# Altium project Project-C_VOLTAGE.PrjPCB (part 6 of 6)
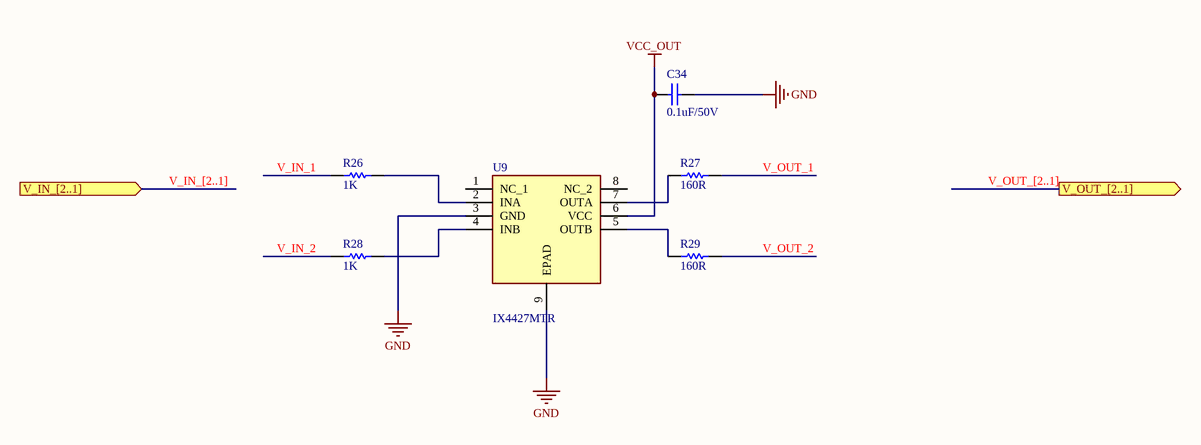
[diagram p13: VoltageAmplifier.SchDoc]

## Nets that join several sheets (continued)
V_OUT230: VoltageHeaders (P_E_4.6), U_VoltageAmplifier_1xFPGA4/U_VoltageAmplifier3 (R27_U_VoltageAmplifier_1xFPGA4_U_VoltageAmplifier3.2)
V_OUT231: VoltageHeaders (P_E_4.8), U_VoltageAmplifier_1xFPGA4/U_VoltageAmplifier3 (R29_U_VoltageAmplifier_1xFPGA4_U_VoltageAmplifier3.2)
V_OUT232: VoltageHeaders (P_E_4.7), U_VoltageAmplifier_1xFPGA4/U_VoltageAmplifier4 (R27_U_VoltageAmplifier_1xFPGA4_U_VoltageAmplifier4.2)
V_OUT233: VoltageHeaders (P_E_4.5), U_VoltageAmplifier_1xFPGA4/U_VoltageAmplifier4 (R29_U_VoltageAmplifier_1xFPGA4_U_VoltageAmplifier4.2)
V_OUT234: VoltageHeaders (P_E_4.10), U_VoltageAmplifier_1xFPGA4/U_VoltageAmplifier5 (R27_U_VoltageAmplifier_1xFPGA4_U_VoltageAmplifier5.2)
V_OUT251: VoltageHeaders (P_E_4.28), U_VoltageAmplifier_1xFPGA4/U_VoltageAmplifier13 (R29_U_VoltageAmplifier_1xFPGA4_U_VoltageAmplifier13.2)
V_OUT252: VoltageHeaders (P_E_4.27), U_VoltageAmplifier_1xFPGA4/U_VoltageAmplifier14 (R27_U_VoltageAmplifier_1xFPGA4_U_VoltageAmplifier14.2)
V_OUT253: VoltageHeaders (P_E_4.25), U_VoltageAmplifier_1xFPGA4/U_VoltageAmplifier14 (R29_U_VoltageAmplifier_1xFPGA4_U_VoltageAmplifier14.2)
V_OUT254: VoltageHeaders (P_E_4.30), U_VoltageAmplifier_1xFPGA4/U_VoltageAmplifier15 (R27_U_VoltageAmplifier_1xFPGA4_U_VoltageAmplifier15.2)
V_OUT255: VoltageHeaders (P_E_4.32), U_VoltageAmplifier_1xFPGA4/U_VoltageAmplifier15 (R29_U_VoltageAmplifier_1xFPGA4_U_VoltageAmplifier15.2)
V_OUT256: VoltageHeaders (P_E_4.31), U_VoltageAmplifier_1xFPGA4/U_VoltageAmplifier16 (R27_U_VoltageAmplifier_1xFPGA4_U_VoltageAmplifier16.2)
V_OUT257: VoltageHeaders (P_E_4.29), U_VoltageAmplifier_1xFPGA4/U_VoltageAmplifier16 (R29_U_VoltageAmplifier_1xFPGA4_U_VoltageAmplifier16.2)
V_OUT258: VoltageHeaders (P_E_4.34), U_VoltageAmplifier_1xFPGA4/U_VoltageAmplifier17 (R27_U_VoltageAmplifier_1xFPGA4_U_VoltageAmplifier17.2)
V_OUT259: VoltageHeaders (P_E_4.36), U_VoltageAmplifier_1xFPGA4/U_VoltageAmplifier17 (R29_U_VoltageAmplifier_1xFPGA4_U_VoltageAmplifier17.2)
V_OUT260: VoltageHeaders (P_E_4.35), U_VoltageAmplifier_1xFPGA4/U_VoltageAmplifier18 (R27_U_VoltageAmplifier_1xFPGA4_U_VoltageAmplifier18.2)
V_OUT261: VoltageHeaders (P_E_4.33), U_VoltageAmplifier_1xFPGA4/U_VoltageAmplifier18 (R29_U_VoltageAmplifier_1xFPGA4_U_VoltageAmplifier18.2)
V_OUT262: VoltageHeaders (P_E_4.38), U_VoltageAmplifier_1xFPGA4/U_VoltageAmplifier19 (R27_U_VoltageAmplifier_1xFPGA4_U_VoltageAmplifier19.2)
V_OUT263: VoltageHeaders (P_E_4.37), U_VoltageAmplifier_1xFPGA4/U_VoltageAmplifier19 (R29_U_VoltageAmplifier_1xFPGA4_U_VoltageAmplifier19.2)
V_OUT264: VoltageHeaders (P_O_4.3), U_VoltageAmplifier_1xFPGA4/U_VoltageAmplifier20 (R27_U_VoltageAmplifier_1xFPGA4_U_VoltageAmplifier20.2)
V_OUT265: VoltageHeaders (P_O_4.1), U_VoltageAmplifier_1xFPGA4/U_VoltageAmplifier20 (R29_U_VoltageAmplifier_1xFPGA4_U_VoltageAmplifier20.2)
V_OUT266: VoltageHeaders (P_O_4.2), U_VoltageAmplifier_1xFPGA4/U_VoltageAmplifier21 (R27_U_VoltageAmplifier_1xFPGA4_U_VoltageAmplifier21.2)
V_OUT267: VoltageHeaders (P_O_4.4), U_VoltageAmplifier_1xFPGA4/U_VoltageAmplifier21 (R29_U_VoltageAmplifier_1xFPGA4_U_VoltageAmplifier21.2)
V_OUT268: VoltageHeaders (P_O_4.7), U_VoltageAmplifier_1xFPGA4/U_VoltageAmplifier22 (R27_U_VoltageAmplifier_1xFPGA4_U_VoltageAmplifier22.2)
V_OUT269: VoltageHeaders (P_O_4.5), U_VoltageAmplifier_1xFPGA4/U_VoltageAmplifier22 (R29_U_VoltageAmplifier_1xFPGA4_U_VoltageAmplifier22.2)
V_OUT270: VoltageHeaders (P_O_4.6), U_VoltageAmplifier_1xFPGA4/U_VoltageAmplifier23 (R27_U_VoltageAmplifier_1xFPGA4_U_VoltageAmplifier23.2)
V_OUT271: VoltageHeaders (P_O_4.8), U_VoltageAmplifier_1xFPGA4/U_VoltageAmplifier23 (R29_U_VoltageAmplifier_1xFPGA4_U_VoltageAmplifier23.2)
V_OUT272: VoltageHeaders (P_O_4.11), U_VoltageAmplifier_1xFPGA4/U_VoltageAmplifier24 (R27_U_VoltageAmplifier_1xFPGA4_U_VoltageAmplifier24.2)
V_OUT273: VoltageHeaders (P_O_4.9), U_VoltageAmplifier_1xFPGA4/U_VoltageAmplifier24 (R29_U_VoltageAmplifier_1xFPGA4_U_VoltageAmplifier24.2)
V_OUT274: VoltageHeaders (P_O_4.10), U_VoltageAmplifier_1xFPGA4/U_VoltageAmplifier25 (R27_U_VoltageAmplifier_1xFPGA4_U_VoltageAmplifier25.2)
V_OUT275: VoltageHeaders (P_O_4.12), U_VoltageAmplifier_1xFPGA4/U_VoltageAmplifier25 (R29_U_VoltageAmplifier_1xFPGA4_U_VoltageAmplifier25.2)
V_OUT276: VoltageHeaders (P_O_4.15), U_VoltageAmplifier_1xFPGA4/U_VoltageAmplifier26 (R27_U_VoltageAmplifier_1xFPGA4_U_VoltageAmplifier26.2)
V_OUT277: VoltageHeaders (P_O_4.13), U_VoltageAmplifier_1xFPGA4/U_VoltageAmplifier26 (R29_U_VoltageAmplifier_1xFPGA4_U_VoltageAmplifier26.2)
V_OUT278: VoltageHeaders (P_O_4.14), U_VoltageAmplifier_1xFPGA4/U_VoltageAmplifier27 (R27_U_VoltageAmplifier_1xFPGA4_U_VoltageAmplifier27.2)
V_OUT279: VoltageHeaders (P_O_4.16), U_VoltageAmplifier_1xFPGA4/U_VoltageAmplifier27 (R29_U_VoltageAmplifier_1xFPGA4_U_VoltageAmplifier27.2)
V_OUT280: VoltageHeaders (P_O_4.19), U_VoltageAmplifier_1xFPGA4/U_VoltageAmplifier28 (R27_U_VoltageAmplifier_1xFPGA4_U_VoltageAmplifier28.2)
V_OUT281: VoltageHeaders (P_O_4.17), U_VoltageAmplifier_1xFPGA4/U_VoltageAmplifier28 (R29_U_VoltageAmplifier_1xFPGA4_U_VoltageAmplifier28.2)
V_OUT282: VoltageHeaders (P_O_4.18), U_VoltageAmplifier_1xFPGA4/U_VoltageAmplifier29 (R27_U_VoltageAmplifier_1xFPGA4_U_VoltageAmplifier29.2)
V_OUT283: VoltageHeaders (P_O_4.20), U_VoltageAmplifier_1xFPGA4/U_VoltageAmplifier29 (R29_U_VoltageAmplifier_1xFPGA4_U_VoltageAmplifier29.2)
V_OUT284: VoltageHeaders (P_O_4.23), U_VoltageAmplifier_1xFPGA4/U_VoltageAmplifier30 (R27_U_VoltageAmplifier_1xFPGA4_U_VoltageAmplifier30.2)
V_OUT285: VoltageHeaders (P_O_4.21), U_VoltageAmplifier_1xFPGA4/U_VoltageAmplifier30 (R29_U_VoltageAmplifier_1xFPGA4_U_VoltageAmplifier30.2)
V_OUT286: VoltageHeaders (P_O_4.22), U_VoltageAmplifier_1xFPGA4/U_VoltageAmplifier31 (R27_U_VoltageAmplifier_1xFPGA4_U_VoltageAmplifier31.2)
V_OUT287: VoltageHeaders (P_O_4.24), U_VoltageAmplifier_1xFPGA4/U_VoltageAmplifier31 (R29_U_VoltageAmplifier_1xFPGA4_U_VoltageAmplifier31.2)
V_OUT288: VoltageHeaders (P_O_4.27), U_VoltageAmplifier_1xFPGA4/U_VoltageAmplifier32 (R27_U_VoltageAmplifier_1xFPGA4_U_VoltageAmplifier32.2)
V_OUT289: VoltageHeaders (P_O_4.25), U_VoltageAmplifier_1xFPGA4/U_VoltageAmplifier32 (R29_U_VoltageAmplifier_1xFPGA4_U_VoltageAmplifier32.2)
V_OUT290: VoltageHeaders (P_O_4.26), U_VoltageAmplifier_1xFPGA4/U_VoltageAmplifier33 (R27_U_VoltageAmplifier_1xFPGA4_U_VoltageAmplifier33.2)
V_OUT291: VoltageHeaders (P_O_4.28), U_VoltageAmplifier_1xFPGA4/U_VoltageAmplifier33 (R29_U_VoltageAmplifier_1xFPGA4_U_VoltageAmplifier33.2)
V_OUT292: VoltageHeaders (P_O_4.31), U_VoltageAmplifier_1xFPGA4/U_VoltageAmplifier34 (R27_U_VoltageAmplifier_1xFPGA4_U_VoltageAmplifier34.2)
V_OUT293: VoltageHeaders (P_O_4.29), U_VoltageAmplifier_1xFPGA4/U_VoltageAmplifier34 (R29_U_VoltageAmplifier_1xFPGA4_U_VoltageAmplifier34.2)
V_OUT294: VoltageHeaders (P_O_4.30), U_VoltageAmplifier_1xFPGA4/U_VoltageAmplifier35 (R27_U_VoltageAmplifier_1xFPGA4_U_VoltageAmplifier35.2)
V_OUT295: VoltageHeaders (P_O_4.32), U_VoltageAmplifier_1xFPGA4/U_VoltageAmplifier35 (R29_U_VoltageAmplifier_1xFPGA4_U_VoltageAmplifier35.2)
V_OUT296: VoltageHeaders (P_O_4.35), U_VoltageAmplifier_1xFPGA4/U_VoltageAmplifier36 (R27_U_VoltageAmplifier_1xFPGA4_U_VoltageAmplifier36.2)
V_OUT297: VoltageHeaders (P_O_4.33), U_VoltageAmplifier_1xFPGA4/U_VoltageAmplifier36 (R29_U_VoltageAmplifier_1xFPGA4_U_VoltageAmplifier36.2)
V_OUT298: VoltageHeaders (P_O_4.34), U_VoltageAmplifier_1xFPGA4/U_VoltageAmplifier37 (R27_U_VoltageAmplifier_1xFPGA4_U_VoltageAmplifier37.2)
V_OUT299: VoltageHeaders (P_O_4.36), U_VoltageAmplifier_1xFPGA4/U_VoltageAmplifier37 (R29_U_VoltageAmplifier_1xFPGA4_U_VoltageAmplifier37.2)
V_OUT300: VoltageHeaders (P_O_4.37), U_VoltageAmplifier_1xFPGA4/U_VoltageAmplifier38 (R27_U_VoltageAmplifier_1xFPGA4_U_VoltageAmplifier38.2)
V_SENSE: TOP_VOLTAGE (J1.3), POWER_VOLTAGE (R46.2 R49.2)
VCC_FPGA: TOP_VOLTAGE (R30.1), F2/IO (38 pins), F2/POWER (44 pins)
VCC_FPGA: TOP_VOLTAGE (R31.1), F3/IO (38 pins), F3/POWER (44 pins)
VCC_FPGA: TOP_VOLTAGE (R33.1 R34.1), F4/IO (38 pins), F4/POWER (44 pins)
VCC_FPGA: F1/IO (38 pins), F1/POWER (44 pins)
XSIG: F1/IO (P1_F1_IO.26), F2/IO (P1_F2_IO.26), F3/IO (P1_F3_IO.26), F4/IO (P1_F4_IO.26)